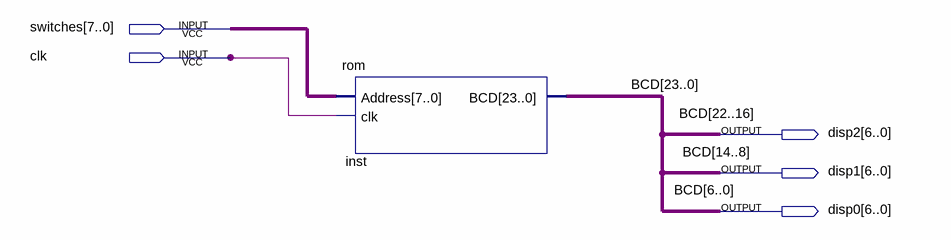
[diagram p0: schematic sheet]
// Quartus schematic lab7.bdf as structural Verilog: 1 symbols, 5 pins
module lab7 (
  input  [7:0] switches,
  input  clk,
  output [6:0] disp2,
  output [6:0] disp1,
  output [6:0] disp0
);

  wire [23:7] BCD;

  rom inst (.Address(switches), .clk(clk), .BCD({BCD[23], disp2, BCD[15], disp1, BCD[7], disp0}));

  // Other names for the same wires on the sheet: BCD (some bits) = {disp2, disp1, disp0}
endmodule
